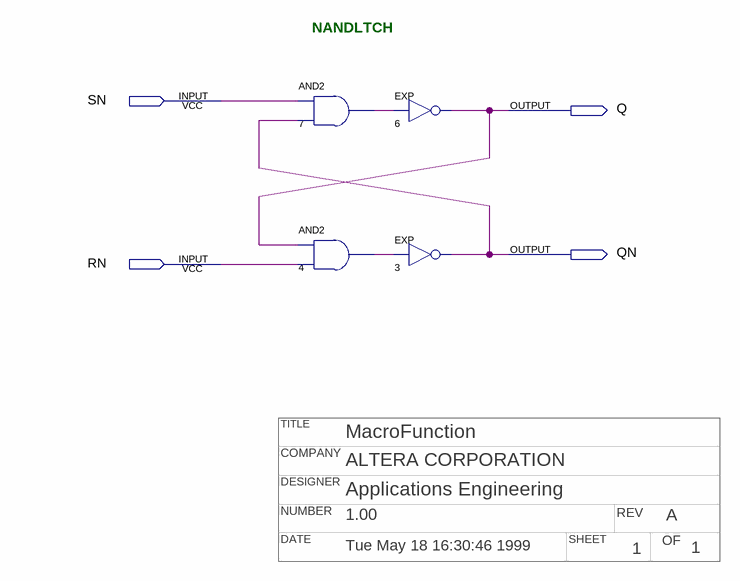
[diagram p0: schematic sheet]
// Quartus schematic nandltch.bdf as structural Verilog: 4 symbols, 4 pins
// Title block: TITLE: MacroFunction; COMPANY: ALTERA CORPORATION; DESIGNER: Applications Engineering; NUMBER: 1.00; REV: A; DATE: Tue May 18 16:30:46 1999; SHEET: 1; OF: 1
module nandltch (
  input  SN,
  input  RN,
  output Q,
  output QN
);

  wire n4_out, n7_out;

  and u_7 (n7_out, SN, QN);
  and u_4 (n4_out, Q, RN);
  EXP u_6 (.IN(n7_out), .OUT(Q));
  EXP u_3 (.IN(n4_out), .OUT(QN));

  // Notes on the sheet:
  //   NANDLTCH
endmodule
